# Altium schematic sheet SeniorCapstoneDraft.SchDoc
size A; SheetNumber: 1; SheetTotal: 1
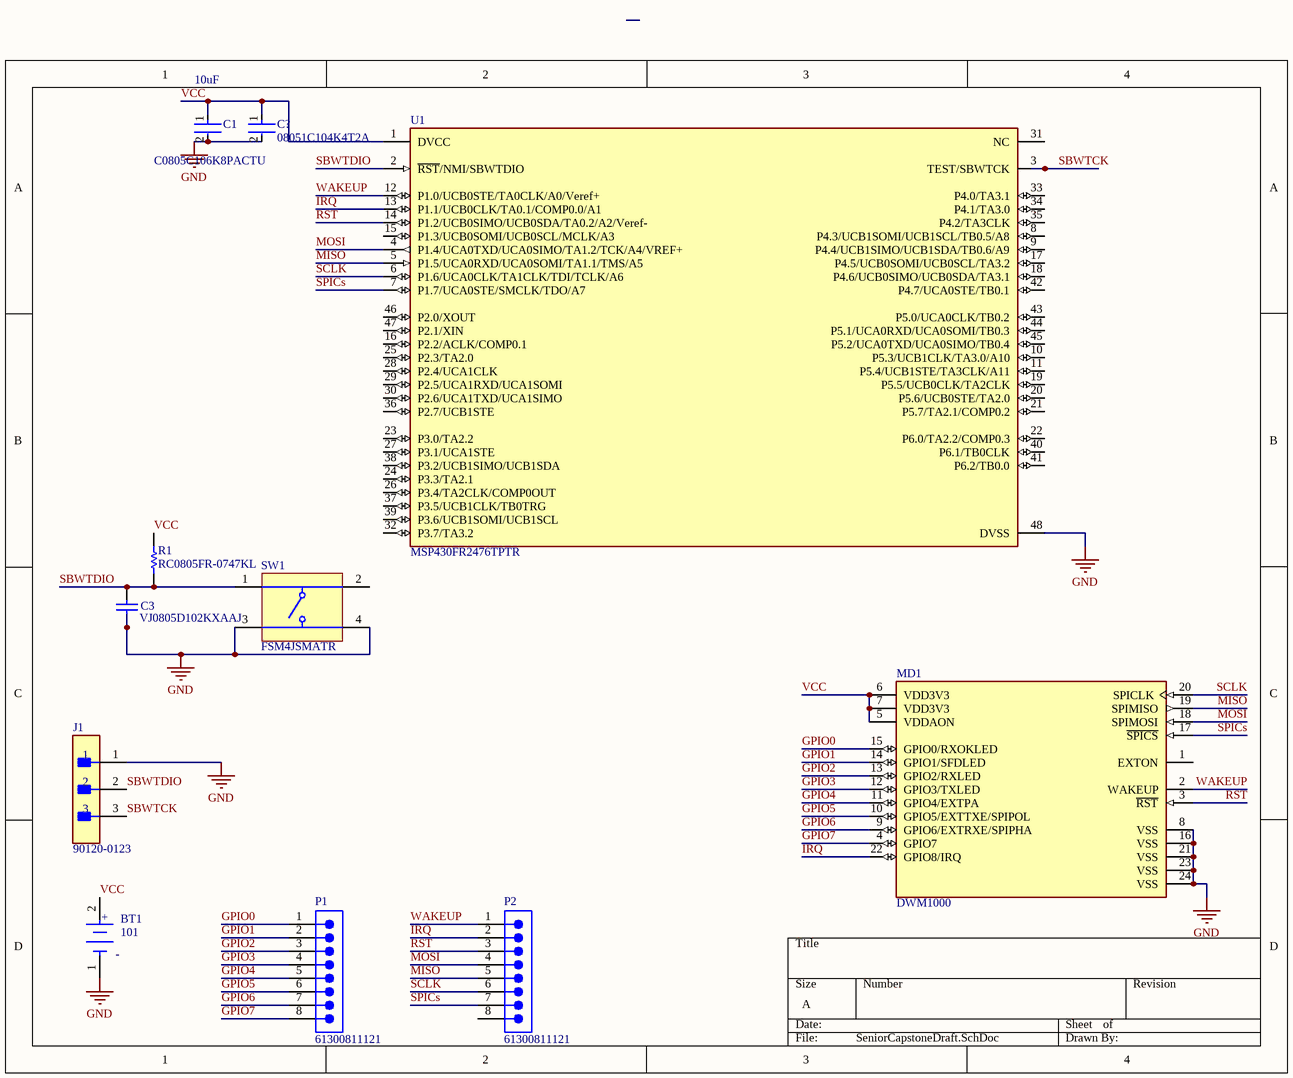
[diagram p0: SeniorCapstoneDraft.SchDoc]

## Parts
BT1  101  [FP-101-MFG]
C1  C0805C106K8PACTU  Capacitance: 10uF  [FP-C0805C-DG-MFG]
C3  VJ0805D102KXAAJ  [CAPC2013X145X48LL20T23]
C?  08051C104K4T2A  [FP-0805-L_2_01_0_2-W_1_25-IPC_B]
J1  90120-0123  [FP-90120-0123-MFG]
MD1  DWM1000  [FP-DWM1000-MFG]
P1  61300811121  [61300811121]
P2  61300811121  [61300811121]
R1  RC0805FR-0747KL  [RESC2013X60X35NL10T20]
SW1  FSM4JSMATR  [TECO-FSM4JSMATR_V]
U1  MSP430FR2476TPTR  [FP-PT0048A-MFG]

## Nets
GND: BT1.1(C) C1.2 C3.1 C?.2 J1.1 MD1.8(VSS) MD1.16(VSS) MD1.21(VSS) MD1.23(VSS) MD1.24(VSS) SW1.3 SW1.4 U1.48(DVSS)
GPIO0: MD1.15(GPIO0/RXOKLED) P1.1
GPIO1: MD1.14(GPIO1/SFDLED) P1.2
GPIO2: MD1.13(GPIO2/RXLED) P1.3
GPIO3: MD1.12(GPIO3/TXLED) P1.4
GPIO4: MD1.11(GPIO4/EXTPA) P1.5
GPIO5: MD1.10(GPIO5/EXTTXE/SPIPOL) P1.6
GPIO6: MD1.9(GPIO6/EXTRXE/SPIPHA) P1.7
GPIO7: MD1.4(GPIO7) P1.8
IRQ: MD1.22(GPIO8/IRQ) P2.2 U1.13(P1.1/UCB0CLK/TA0.1/COMP0.0/A1)
MISO: MD1.19(SPIMISO) P2.5 U1.5(P1.5/UCA0RXD/UCA0SOMI/TA1.1/TMS/A5)
MOSI: MD1.18(SPIMOSI) P2.4 U1.4(P1.4/UCA0TXD/UCA0SIMO/TA1.2/TCK/A4/VREF+)
RST: MD1.3(~{RST}) P2.3 U1.14(P1.2/UCB0SIMO/UCB0SDA/TA0.2/A2/Veref-)
SBWTCK: J1.3 U1.3(TEST/SBWTCK)
SBWTDIO: C3.2 J1.2 R1.1 SW1.1 U1.2(~{RST}/NMI/SBWTDIO)
SCLK: MD1.20(SPICLK) P2.6 U1.6(P1.6/UCA0CLK/TA1CLK/TDI/TCLK/A6)
SPICs: MD1.17(~{SPICS}) P2.7 U1.7(P1.7/UCA0STE/SMCLK/TDO/A7)
VCC: BT1.2(A) C1.1 C?.1 MD1.5(VDDAON) MD1.6(VDD3V3) MD1.7(VDD3V3) R1.2 U1.1(DVCC)
WAKEUP: MD1.2(WAKEUP) P2.1 U1.12(P1.0/UCB0STE/TA0CLK/A0/Veref+)

Not connected (* = marked no-connect by the designer): MD1 1(EXTON); P2 8; SW1 2; U1 8(P4.3/UCB1SOMI/UCB1SCL/TB0.5/A8) 9(P4.4/UCB1SIMO/UCB1SDA/TB0.6/A9) 10(P5.3/UCB1CLK/TA3.0/A10) 11(P5.4/UCB1STE/TA3CLK/A11) 15(P1.3/UCB0SOMI/UCB0SCL/MCLK/A3) 16(P2.2/ACLK/COMP0.1) 17(P4.5/UCB0SOMI/UCB0SCL/TA3.2) 18(P4.6/UCB0SIMO/UCB0SDA/TA3.1) 19(P5.5/UCB0CLK/TA2CLK) 20(P5.6/UCB0STE/TA2.0) 21(P5.7/TA2.1/COMP0.2) 22(P6.0/TA2.2/COMP0.3) 23(P3.0/TA2.2) 24(P3.3/TA2.1) 25(P2.3/TA2.0) 26(P3.4/TA2CLK/COMP0OUT) 27(P3.1/UCA1STE) 28(P2.4/UCA1CLK) 29(P2.5/UCA1RXD/UCA1SOMI) 30(P2.6/UCA1TXD/UCA1SIMO) 31(NC) 32(P3.7/TA3.2) 33(P4.0/TA3.1) 34(P4.1/TA3.0) 35(P4.2/TA3CLK) 36(P2.7/UCB1STE) 37(P3.5/UCB1CLK/TB0TRG) 38(P3.2/UCB1SIMO/UCB1SDA) 39(P3.6/UCB1SOMI/UCB1SCL) 40(P6.1/TB0CLK) 41(P6.2/TB0.0) 42(P4.7/UCA0STE/TB0.1) 43(P5.0/UCA0CLK/TB0.2) 44(P5.1/UCA0RXD/UCA0SOMI/TB0.3) 45(P5.2/UCA0TXD/UCA0SIMO/TB0.4) 46(P2.0/XOUT) 47(P2.1/XIN)

## Notes on the sheet
- (in symbol CMP-19636-000018-1) +

## Library data of the parts
BT1 = CMP-19636-000018-1: BATTERY HOLDER COIN 20MM PC PIN; Body Material: PBT; Number of Batteries: 1; Packaging: Bag; Lead Free: Lead Free; Package Quantity: 1; Contact Plating: Tin; Termination: PC Pin; REACH SVHC: No SVHC; Material: Steel; Mount: Through Hole; Max Operating Temperature: 145°C; Min Operating Temperature: -50°C; Number of Cells: 1; Series: -
C1 = CMP-2007-03243-2: CAP CER 10UF 10V X5R 0805; Manufacturer: Kemet; 3DS Part Number: 220-00001; Tolerance: 10%; Temperature Coefficient: 15%; Material: Ceramic; Device Class L2: Capacitors; Device Class L1: Passive Components; ComponentLink2URL: https://content.kemet.com/datasheets/KEM_C1006_X5R_SMD.pdf; Height: 1.4mm; Lead Free: Yes; Manufacturer Part Number: C0805C106K8PACTU; Digikey Description: CAP CER 10UF 10V X5R 0805; Octopart: https://octopart.com/c0805c106k8pactu-kemet-98697; Value: 10uF; Temperature Range Low: -55°C; Temperature: -55°C to +85°C; Automotive: No; Mouser Description: CAP CER 10UF 10V X5R 0805; Ipc Land Pattern Name: CAPC200125X125; Temperature Range High: +85°C; Voltage: 10V; RoHS: TRUE; Device Class L3: Ceramic Capacitors; ComponentLink2Description: Datasheet; Voltage Rating: 10V; Package: C0805C-DG; Temperature Characteristic: X5R; Category: Cap
C3 = CMP-2007-03135-1: Manufacturer: Vitramon; Part Number: VJ0805D102KXAAJ
C? = CMP-2007-04172-2: Automotive Ceramic Capacitor, 0805, 100nF, 10%, X7R, 15%, 100V; Voltage Rating (DC): 100V; Case Code (Metric): 2012; Mount: Surface Mount; Length: 2.01mm; Depth: 1.25mm; Lead Free: Lead Free; Ratings: AEC-Q200; Max Operating Temperature: 125°C; Tolerance: 10%; Case/Package: 0805; Width: 0.049inch; Package Quantity: 1; Thickness: 0.055inch; Construction: Flat; Min Operating Temperature: -55°C; REACH SVHC: No SVHC; Number of Pins: 2; Radiation Hardening: No; Capacitance: 100nF; Voltage Rating: 100V; Height: 1.4mm; Series: -; Voltage: 100V; Dielectric: X7R; Termination: SMD/SMT; Case Code (Imperial): 0805; RoHS Compliant: Yes; Packaging: Tape and Reel; Dielectric Material: Ceramic
J1 = CMP-04776-000237-1: CONN HEADER VERT 3POS 2.54MM; Number of Circuits: 3; Max Voltage Rating (DC): 350.35kV; Contact Resistance: 20mR; Gender: Male; Voltage Rating (AC): 350V; Glow Wire Compliant: Non-compliant; Current Rating: 3A; Contact Post Length: 2.9mm; Number of Contacts: 3; Number of Rows: 1; Max Operating Temperature: 125°C; Orientation: Vertical; Number of Positions: 3; Packaging: Tray; Contact Mating Length: 6.75mm; Housing Color: Black; Termination: Solder; Contact Material: Brass; Radiation Hardening: No; Lead Free: Lead Free; Pitch: 2.54mm; RoHS Compliant: Yes; Voltage Rating: 350V; Contact Plating: Tin; Color: Black; Min Operating Temperature: -55°C; Mount: Through Hole; Housing Material: Polyester; Series: 90120; Contact Gender: Male; REACH SVHC: No SVHC
MD1 = CMP-231853-000001-1: RX TXRX MODULE 802.15.4 CHIP SMD
P1 P2 = CMP-1502-01076-2: NexarPartId: 32855533; Current Rating: 3A; Connector Type: Male Pin; Voltage Rating: 250V; Number of Contacts: 8; Pitch: 2.54mm; Contact Resistance: 20mΩ; Gender: Male; REACH SVHC: Unknown; Number of Rows: 1; Mount: Through Hole; Termination: Solder; Number of Pins: 8; Number of Positions: 8; Height: 8.54mm; Contact Mating Length: 5.9944mm; Orientation: Vertical; Operating Supply Voltage: 250V; Min Operating Temperature: -40°C; Max Operating Temperature: 105°C; Packaging: Bulk; Color: Black; Lead Pitch: 2.54mm; RoHS: Compliant; Contact Material: Copper; Contact Plating: Gold
R1 = CMP-1659-00011-4: Chip Resistor, 47 KOhm, +/- 1%, 0.125 W, -55 to 155 degC, 0805 (2012 Metric), RoHS, Tape and Reel; Manufacturer: Yageo; Voltage Rating: 150 V; Height: 0.5 mm; ComponentLink2URL: http://www.yageo.com/documents/recent/PYu-RC_Group_51_RoHS_L_04.pdf; ComponentLink2Description: Datasheet; Package Quantity: 200; Max Operating Temperature: 155 degC; Min Operating Temperature: -55 degC; Packaging: Tape and Reel; Pins: 2; PackageReference: 0805; Mounting Technology: Surface Mount; ComponentLink1Description: Manufacturer URL; ComponentLink1URL: http://www.yageo.com/; PackageDescription: 2-Pin Surface Mounted Device, Body 2 x 1.25 mm; Length: 2 mm; REACH SVHC: No SVHC; Mount: Surface Mount; RoHSCompliant: true; DatasheetVersion: Rev. 4, 02/2016
SW1 = CMP-2000-07486-1: Micro Miniature Push Button Switch FSM JSM, 50 mA, -35 to 85 degC, 4-Pin SMD, RoHS, Tape and Reel; Manufacturer: TE Connectivity; Mechanical Life: 100000Cycles; Current Rating: 50mA; Actuator Material: Polyamide; Max Voltage Rating (DC): 12V; Capacitance: 0f; Illumination Type: Illuminated; Voltage Rating (DC): 24V; Case\/Package: SMD/SMT; Operating Force: 160gf; Contact Resistance: 100mOhm; Actuator Length: 0.055inch; Switch Travel: 0.25mm; Throw Configuration: SPST; Termination: GullWing; Contact Plating: Silver; Orientation: Straight; Mounting Technology: SurfaceMount; REACH SVHC: Unknown; Electrical Life: 100000Cycles; Package Reference: FSM4JSMATR; Max Operating Temperature: 85degC; Manufacturer URL: http://www.te.com/; Package Description: 4-Pin Surface Mount Device, Body 6 x 6 mm, Pitch 4.5 mm; Datasheet Version: Rev. V, 02/2015; Packaging: TapeandReel; Min Operating Temperature: -35degC; Mount: SurfaceMount; Contact Current Rating: 50mA; Contact Material: CopperAlloy; Package Quantity: 1200; Datasheet URL: http://www.te.com/commerce/DocumentDelivery/DDEController?Action=showdoc&DocId=Customer+Drawing%7F2-1437565-7%7FV%7Fpdf%7FEnglish%7FENG_CD_2-1437565-7_V.pdf%7F4-1437565-2; RoHSCompliant: true
U1 = CMP-04869-000090-1: IC MCU 16BIT 64.5KB FRAM 48LQFP